# Altium schematic sheet SolarPanelsAltium.SchDoc
size A
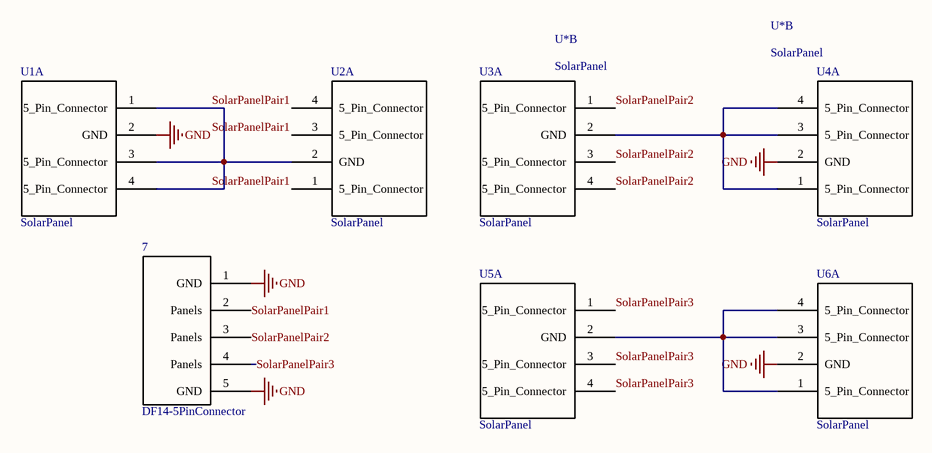
[diagram p0: SolarPanelsAltium.SchDoc]

## Parts
(Parts that share a designator on the sheet are numbered #1, #2 ... from top to bottom, then left to right.)
7  DF14-5PinConnector  [DF14-5P-1.25H(55)]
U1  SolarPanel  [SolarPanel]  (part A of 2)
U2  SolarPanel  [SolarPanel]  (part A of 2)
U3  SolarPanel  [SolarPanel]  (part A of 2)
U4  SolarPanel  [SolarPanel]  (part A of 2)
U5  SolarPanel  [SolarPanel]  (part A of 2)
U6  SolarPanel  [SolarPanel]  (part A of 2)
U*#1  SolarPanel  [SolarPanel]  (part B of 2)
U*#2  SolarPanel  [SolarPanel]  (part B of 2)

## Nets
GND: 7.1(GND) 7.5(GND) U1.2(GND) U4.2(GND) U6.2(GND)
SolarPanelPair1: 7.2(Panels) U2.1(5_Pin_Connector) U2.3(5_Pin_Connector) U2.4(5_Pin_Connector)
SolarPanelPair2: 7.3(Panels) U3.1(5_Pin_Connector) U3.3(5_Pin_Connector) U3.4(5_Pin_Connector)
SolarPanelPair3: 7.4(Panels) U5.1(5_Pin_Connector) U5.3(5_Pin_Connector) U5.4(5_Pin_Connector)
NetU1_1: U1.1(5_Pin_Connector) U1.3(5_Pin_Connector) U1.4(5_Pin_Connector) U2.2(GND)
NetU3_2: U3.2(GND) U4.1(5_Pin_Connector) U4.3(5_Pin_Connector) U4.4(5_Pin_Connector)
NetU5_2: U5.2(GND) U6.1(5_Pin_Connector) U6.3(5_Pin_Connector) U6.4(5_Pin_Connector)